# EAGLE design room-controller-v1 (EAGLE 6.4)
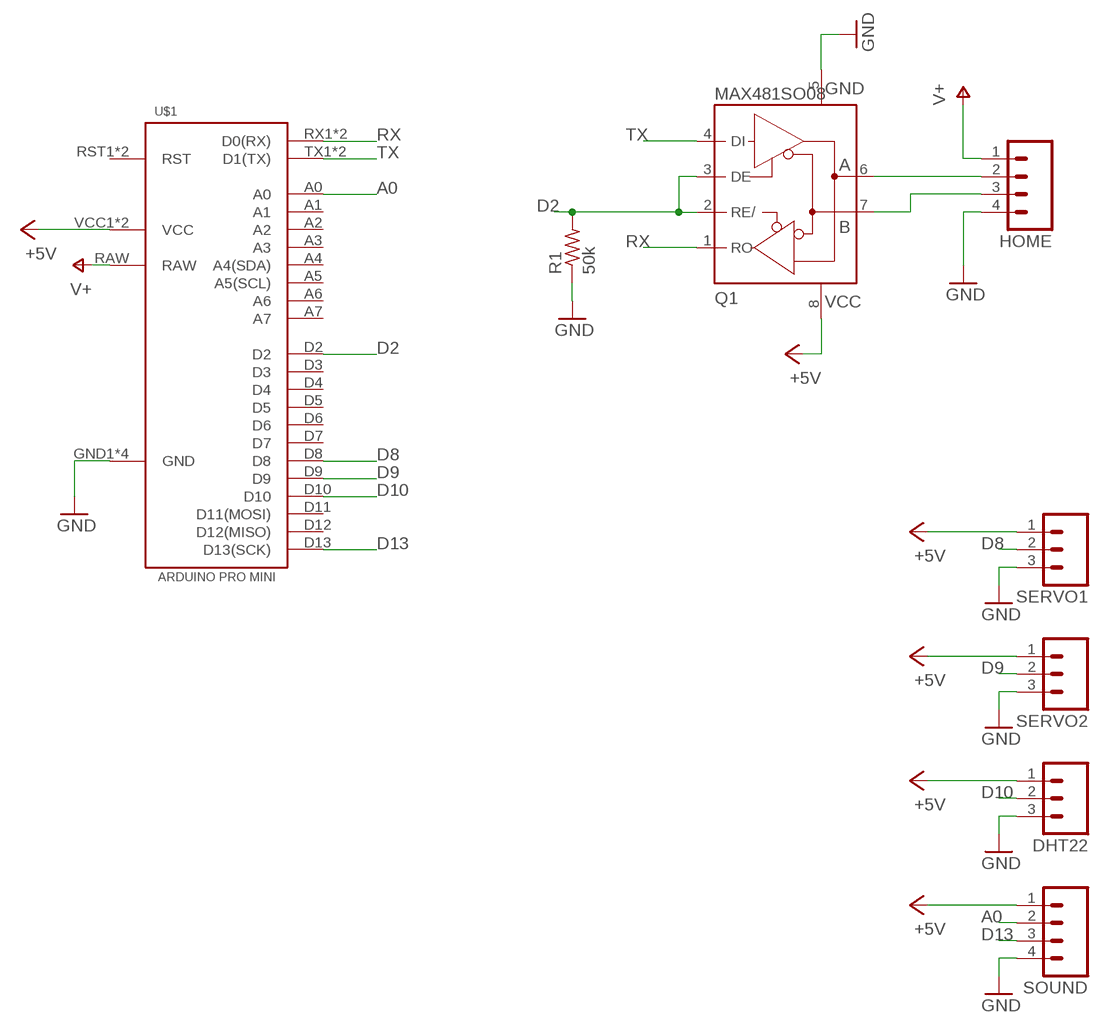
[diagram p0: schematic, sheet 1]

## Parts
DHT22  M03  [03P]
HOME  M04  [04P]
Q1  MAX481SO08  [SO08]
R1  50k  R-US_R0603  [R0603]
SERVO1  M03  [03P]
SERVO2  M03  [03P]
SOUND  M04  [04P]
U$1  ARDUINO-PRO-MINI  [ARDUINO-PRO-MINI]

## Nets
+5V: DHT22.1 Q1.8(+5V) SERVO1.1 SERVO2.1 SOUND.1 U$1.VCC1(VCC) U$1.VCC2(VCC)
A0: SOUND.2 U$1.A0
D2: Q1.2(RE/) Q1.3(DE) R1.2 U$1.D2
D8: SERVO1.2 U$1.D8
D9: SERVO2.2 U$1.D9
D10: DHT22.2 U$1.D10
D13: SOUND.3 U$1.D13(D13(SCK))
GND: DHT22.3 HOME.4 Q1.5(GND) R1.1 SERVO1.3 SERVO2.3 SOUND.4 U$1.GND1(GND) U$1.GND2(GND) U$1.GND3(GND) U$1.GND4(GND)
N$1: HOME.2 Q1.6(A)
N$2: HOME.3 Q1.7(B)
RX: Q1.1(RO) U$1.RX1(D0(RX)) U$1.RX2(D0(RX))
TX: Q1.4(DI) U$1.TX1(D1(TX)) U$1.TX2(D1(TX))
V+: HOME.1 U$1.RAW
Unconnected: U$1.A1 U$1.A2 U$1.A3 U$1.A4(A4(SDA)) U$1.A5(A5(SCL)) U$1.A6 U$1.A7 U$1.D3 U$1.D4 U$1.D5 U$1.D6 U$1.D7 U$1.D11(D11(MOSI)) U$1.D12(D12(MISO)) U$1.RST1(RST) U$1.RST2(RST)

## Library data of the parts
DHT22 SERVO1 SERVO2 = con-amp-quick:M03: AMP QUICK CONNECTOR; OC_FARNELL: unknown; OC_NEWARK: unknown
HOME SOUND = con-amp-quick:M04: AMP QUICK CONNECTOR; OC_FARNELL: unknown; OC_NEWARK: unknown
Q1 = serge:MAX481
R1 = adafruit:R-US_: RESISTOR, American symbol
U$1 = serge:ARDUINO-PRO-MINI

## Board
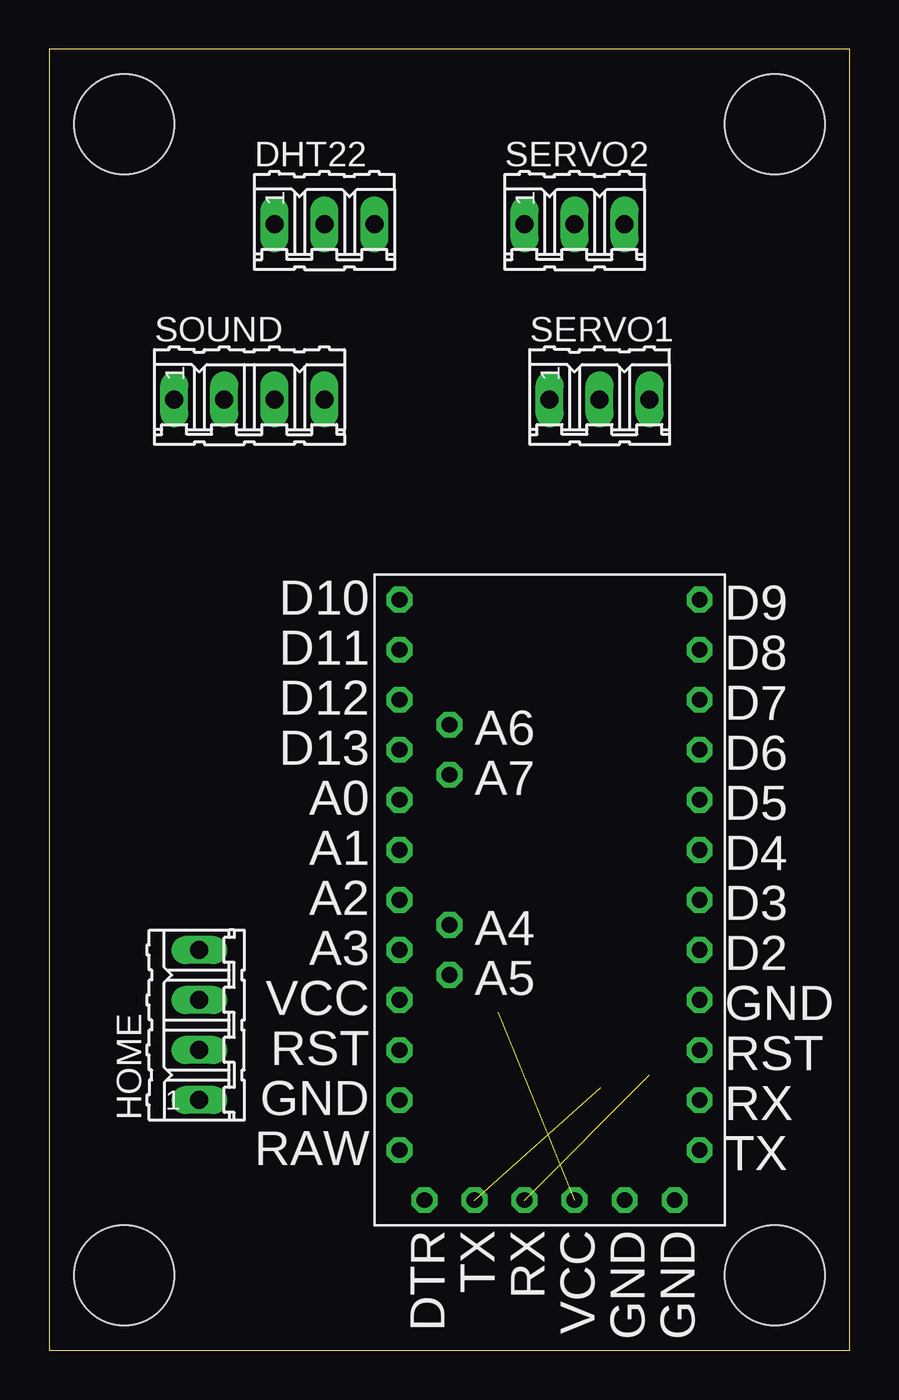
[diagram p1: board, top side]
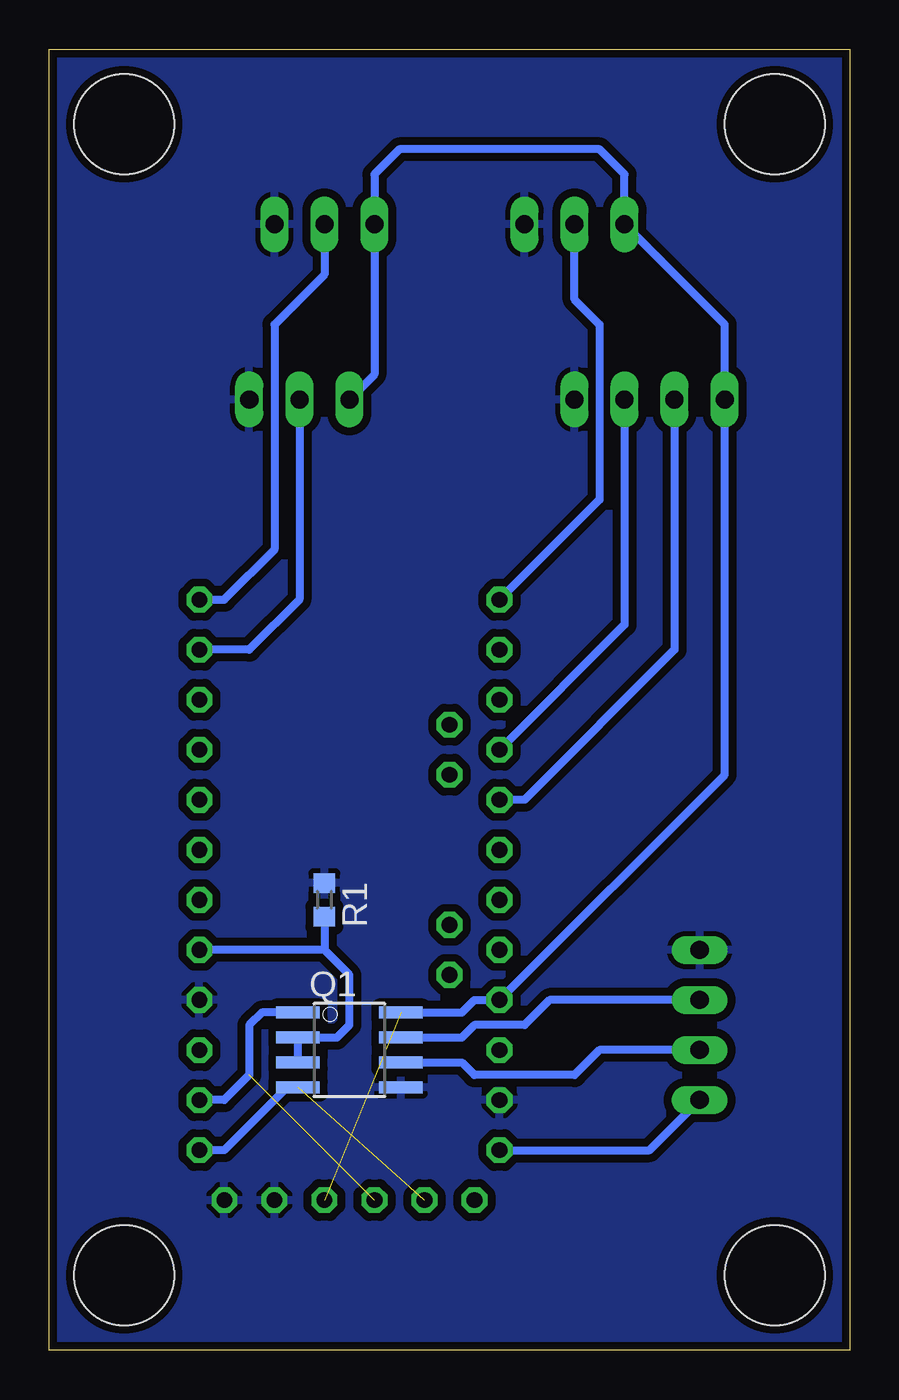
[diagram p2: board, bottom side, seen from below]

Size 40.64 x 66.04 mm. Coordinates in mm from the lower left corner, seen from the top.
Outline: 0,0 40.64,0 40.64,66.04 0,66.04 0,0
Copper layers (1*16): Top 0.035mm / dielectric 1.5mm / Bottom 0.035mm
Design rules "default": minimum track width 10mil, minimum drill 24mil, track to track 16mil, track to pad 16mil, pad to pad 16mil, via to via 16mil, smd to smd 16mil, copper to edge 16mil, drill to drill 8mil, minimum pad ring 10mil, minimum via ring 8mil, stop-mask expansion 4mil, vias tented up to drill 0mil, thermal gap 10mil
Holes 5.08 mm at 3.81,3.81 36.83,3.81 36.83,62.23 3.81,62.23

### Footprints (pad centres in the part's own frame; a part is rotated, then mirrored left to right if it is on the bottom)
03P = drill 0.914 long: 1 -2.54,0; 2 0,0; 3 2.54,0
04P = drill 0.914 long: 1 -3.81,0; 2 -1.27,0; 3 1.27,0; 4 3.81,0
SO08 = smd 0.61 x 2.21: 1 -1.905,-2.616; 2 -0.635,-2.616; 3 0.635,-2.616; 4 1.905,-2.616; 5 1.905,2.616; 6 0.635,2.616; 7 -0.635,2.616; 8 -1.905,2.616
R0603 = smd 1 x 1.1: 1 -0.85,0; 2 0.85,0
ARDUINO-PRO-MINI = drill 0.8 octagon: A0 -3.81,-7.62; A1 -1.27,-7.62; A2 1.27,-7.62; A3 3.81,-7.62; A4 2.54,-5.08; A5 5.08,-5.08; A6 -7.62,-5.08; A7 -5.08,-5.08; D2 3.81,7.62; D3 1.27,7.62; D4 -1.27,7.62; D5 -3.81,7.62; D6 -6.35,7.62; D7 -8.89,7.62; D8 -11.43,7.62; D9 -13.97,7.62; D10 -13.97,-7.62; D11 -11.43,-7.62; D12 -8.89,-7.62; D13 -6.35,-7.62; DTR 16.51,-6.35; GND1 11.43,-7.62; GND2 16.51,6.35; GND3 16.51,3.81; GND4 6.35,7.62; RAW 13.97,-7.62; RST1 8.89,7.62; RST2 8.89,-7.62; RX1 11.43,7.62; RX2 16.51,-1.27; TX1 13.97,7.62; TX2 16.51,-3.81; VCC1 16.51,1.27; VCC2 6.35,-7.62

### Placement (x,y rotation side)
DHT22  13.97,57.15 0 top
HOME  7.62,16.51 90 top
Q1  25.4,15.24 270 bottom
R1  26.67,22.86 270 bottom
SERVO1  27.94,48.26 0 top
SERVO2  26.67,57.15 0 top
SOUND  10.16,48.26 0 top
U$1  25.4,24.13 270 top

### Tracks (layer width: path | path; a pad name or v marks a point on that pad's centre or on a via)
+5V  (1 unrouted)
  Bottom 0.406: Q1.8 19.68,17.14 19.05,17.78 U$1.VCC2 6.35,29.21 SOUND.1 6.35,52.07 DHT22.1 11.43,59.69 12.7,60.96 22.86,60.96 24.13,59.69 SERVO2.1 24.13,49.53 SERVO1.1
A0
  Bottom 0.406: SOUND.2 8.89,35.56 16.51,27.94 U$1.A0
D2
  Bottom 0.406: Q1.3 Q1.2 26.04,15.88 25.4,16.51 25.4,19.05 26.67,20.32 | 26.67,20.32 U$1.D2 | R1.2 26.67,20.32
D8
  Bottom 0.406: U$1.D8 30.48,35.56 27.94,38.1 SERVO1.2
D9
  Bottom 0.406: U$1.D9 31.75,38.1 29.21,40.64 29.21,52.07 26.67,54.61 SERVO2.2
D10
  Bottom 0.406: U$1.D10 12.7,43.18 12.7,52.07 13.97,53.34 DHT22.2
D13
  Bottom 0.406: SOUND.3 11.43,36.83 U$1.D13
GND
  pour Bottom: 0,66.04 40.64,66.04 40.64,0 0,0
N$1
  Bottom 0.406: HOME.2 12.7,15.24 13.97,13.97 19.05,13.97 19.68,14.61 Q1.6
N$2
  Bottom 0.406: HOME.3 15.24,17.78 16.51,16.51 19.05,16.51 19.68,15.88 Q1.7
RX  (1 unrouted)
  Bottom 0.406: Q1.1 29.84,17.14 30.48,16.51 30.48,13.97 31.75,12.7 U$1.RX1
TX  (1 unrouted)
  Bottom 0.406: Q1.4 28.57,13.34 31.75,10.16 U$1.TX1
V+
  Bottom 0.406: U$1.RAW 10.16,10.16 HOME.1